# EAGLE design vcm-scanner (EAGLE 7.2.0)
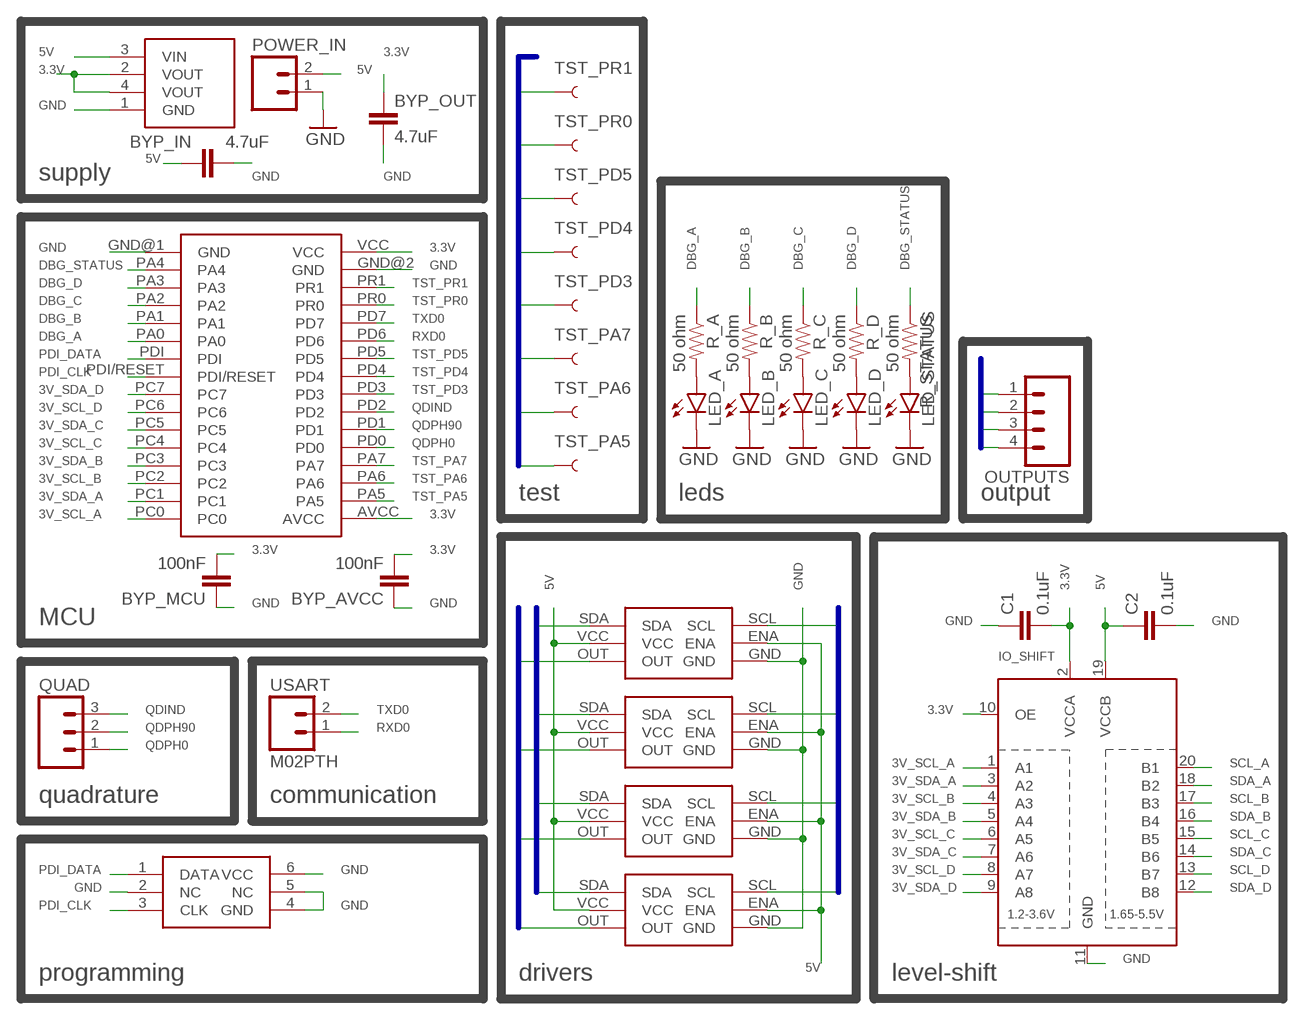
[diagram p0: schematic, sheet 1]

## Parts
BYP_AVCC  100nF  4.7UF-6.3V-10%(0603)0603  [0603-CAP]
BYP_IN  4.7uF  4.7UF-6.3V-10%(0603)0603  [0603-CAP]
BYP_MCU  100nF  4.7UF-6.3V-10%(0603)0603  [0603-CAP]
BYP_OUT  4.7uF  4.7UF-6.3V-10%(0603)0603  [0603-CAP]
C1  0.1uF  0.1UF-25V(+80/-20%)(0603)  [0603-CAP]
C2  0.1uF  0.1UF-25V(+80/-20%)(0603)  [0603-CAP]
DRIVER_A  LV8498CT  [LV8498CT-WLP6K]
DRIVER_B  LV8498CT  [LV8498CT-WLP6K]
DRIVER_C  LV8498CT  [LV8498CT-WLP6K]
DRIVER_D  LV8498CT  [LV8498CT-WLP6K]
IO_SHIFT  TXB0108PWR  [TSSOP20]
LED_A  LED0603  [LED-0603]
LED_B  LED0603  [LED-0603]
LED_C  LED0603  [LED-0603]
LED_D  LED0603  [LED-0603]
LED_STATUS  LED0603  [LED-0603]
MCU  ATXMEGA8E5-32A  [ATXMEGA8E5-32A]
OUTPUTS  M04PTH  [1X04]
PDI_PROG  AVR_PDI_PROG  [2X3]
POWER_IN  M02PTH  [1X02]
QUAD  M03PTH  [1X03]
R_A  50 ohm  RESISTOR0603  [0603-RES]
R_B  50 ohm  RESISTOR0603  [0603-RES]
R_C  50 ohm  RESISTOR0603  [0603-RES]
R_D  50 ohm  RESISTOR0603  [0603-RES]
R_STATUS  50 ohm  RESISTOR0603  [0603-RES]
SUPPLY  ZLDO1117  [SOT223]
TST_PA5  TEST-POINT3X5  [PAD.03X.05]
TST_PA6  TEST-POINT3X5  [PAD.03X.05]
TST_PA7  TEST-POINT3X5  [PAD.03X.05]
TST_PD3  TEST-POINT3X5  [PAD.03X.05]
TST_PD4  TEST-POINT3X5  [PAD.03X.05]
TST_PD5  TEST-POINT3X5  [PAD.03X.05]
TST_PR0  TEST-POINT3X5  [PAD.03X.05]
TST_PR1  TEST-POINT3X5  [PAD.03X.05]
USART  M02PTH  [1X02]

## Nets
3.3V: BYP_AVCC.2 BYP_MCU.2 BYP_OUT.1 C1.2 IO_SHIFT.2(VCCA) IO_SHIFT.10(OE) MCU.AVCC MCU.VCC SUPPLY.2(VOUT) SUPPLY.4(VOUT)
3V_SCL_A: IO_SHIFT.1(A1) MCU.PC0
3V_SCL_B: IO_SHIFT.4(A3) MCU.PC2
3V_SCL_C: IO_SHIFT.6(A5) MCU.PC4
3V_SCL_D: IO_SHIFT.8(A7) MCU.PC6
3V_SDA_A: IO_SHIFT.3(A2) MCU.PC1
3V_SDA_B: IO_SHIFT.5(A4) MCU.PC3
3V_SDA_C: IO_SHIFT.7(A6) MCU.PC5
3V_SDA_D: IO_SHIFT.9(A8) MCU.PC7
5V: BYP_IN.1 C2.1 DRIVER_A.ENA DRIVER_A.VCC DRIVER_B.ENA DRIVER_B.VCC DRIVER_C.ENA DRIVER_C.VCC DRIVER_D.ENA DRIVER_D.VCC IO_SHIFT.19(VCCB) POWER_IN.2 SUPPLY.3(VIN)
DBG_A: MCU.PA0 R_A.1
DBG_B: MCU.PA1 R_B.1
DBG_C: MCU.PA2 R_C.1
DBG_D: MCU.PA3 R_D.1
DBG_STATUS: MCU.PA4 R_STATUS.1
GND: BYP_AVCC.1 BYP_IN.2 BYP_MCU.1 BYP_OUT.2 C1.1 C2.2 DRIVER_A.GND DRIVER_B.GND DRIVER_C.GND DRIVER_D.GND IO_SHIFT.11(GND) LED_A.C LED_B.C LED_C.C LED_D.C LED_STATUS.C MCU.GND@1(GND) MCU.GND@2(GND) PDI_PROG.2(NC) PDI_PROG.4(GND) PDI_PROG.5(NC) PDI_PROG.6(VCC) POWER_IN.1 SUPPLY.1(GND)
N$1: LED_A.A R_A.2
N$2: LED_B.A R_B.2
N$3: LED_C.A R_C.2
N$4: LED_D.A R_D.2
N$5: LED_STATUS.A R_STATUS.2
OUT_A: DRIVER_A.OUT OUTPUTS.1
OUT_B: DRIVER_B.OUT OUTPUTS.2
OUT_C: DRIVER_C.OUT OUTPUTS.3
OUT_D: DRIVER_D.OUT OUTPUTS.4
PDI_CLK: MCU.PDI/RESET PDI_PROG.3(CLK)
PDI_DATA: MCU.PDI PDI_PROG.1(DATA)
QDIND: MCU.PD2 QUAD.3
QDPH0: MCU.PD0 QUAD.1
QDPH90: MCU.PD1 QUAD.2
RXD0: MCU.PD6 USART.1
SCL_A: DRIVER_A.SCL IO_SHIFT.20(B1)
SCL_B: DRIVER_B.SCL IO_SHIFT.17(B3)
SCL_C: DRIVER_C.SCL IO_SHIFT.15(B5)
SCL_D: DRIVER_D.SCL IO_SHIFT.13(B7)
SDA_A: DRIVER_A.SDA IO_SHIFT.18(B2)
SDA_B: DRIVER_B.SDA IO_SHIFT.16(B4)
SDA_C: DRIVER_C.SDA IO_SHIFT.14(B6)
SDA_D: DRIVER_D.SDA IO_SHIFT.12(B8)
TST_PA5: MCU.PA5 TST_PA5.P$1
TST_PA6: MCU.PA6 TST_PA6.P$1
TST_PA7: MCU.PA7 TST_PA7.P$1
TST_PD3: MCU.PD3 TST_PD3.P$1
TST_PD4: MCU.PD4 TST_PD4.P$1
TST_PD5: MCU.PD5 TST_PD5.P$1
TST_PR0: MCU.PR0 TST_PR0.P$1
TST_PR1: MCU.PR1 TST_PR1.P$1
TXD0: MCU.PD7 USART.2

## Buses
OUT_A,OUT_B,OUT_C,OUT_D
SCL_A,SCL_B,SCL_C,SCL_D
SDA_A,SDA_B,SDA_C,SDA_D
TST_PR1,TST_PR0,TST_PD5,TST_PD4,TST_PD3,TST_PA7,TST_PA6,TST_PA5

## Notes on the sheet
- supply
- test | leds | output
- MCU
- quadrature | communication
- programming | drivers | level-shift

## Library data of the parts
BYP_AVCC BYP_MCU = SparkFun-Capacitors:4.7UF-6.3V-10%(0603): CAP-08280; PROD_ID: CAP-08280; VALUE: 4.7uF
BYP_IN BYP_OUT = SparkFun-Capacitors:4.7UF-6.3V-10%(0603): CAP-08280; PROD_ID: CAP-08280
C1 C2 = SparkFun-Capacitors:0.1UF-25V(+80/-20%)(0603): CAP-00810 Ceramic Standard decoupling cap; PROD_ID: CAP-00810
DRIVER_A DRIVER_B DRIVER_C DRIVER_D = owen:LV8498CT
IO_SHIFT = adafruit:TXB0108PWR: 8-Bit Bi-Directional Level Shifter 1.2V-3.6V (VCCA) to 1.65V-5.5V (VCCB) bi-directional level shifter with auto direction sensing. Max data rate - VCCA 1.8V: 20Mbps (50ns), VCCA 3.3V: 100Mbps (10ns) Digikey: 296-21527-1-ND
LED_A LED_B LED_C LED_D LED_STATUS = SparkFun-LED:LED: LEDs Standard schematic elements and footprints for 5mm, 3mm, 1206, and 0603 sized LEDs. 5mm - Spark Fun Electronics SKU : COM-00529 (and others)
MCU = owen:ATXMEGA8E5-32A
OUTPUTS = SparkFun-Connectors:M04: Header 4 Standard 4-pin 0.1" header. Use with straight break away headers (SKU : PRT-00116), right angle break away headers (PRT-00553), swiss pins (PRT-00743), machine pins (PRT-00117), and female headers (PRT-00115). Molex polarized connector foot print use with SKU : PRT-08231 with associated crimp pins and housings. 1MM SMD Version SKU: PRT-10208
PDI_PROG = owen:AVR_PDI_PROG
POWER_IN USART = SparkFun-Connectors:M02: Standard 2-pin 0.1" header. Use with - straight break away headers ( PRT-00116) - right angle break away headers (PRT-00553) - swiss pins (PRT-00743) - machine pins (PRT-00117) - female headers (PRT-00115) Molex polarized connector foot print use with: PRT-08233 with associated crimp pins and housings. 2.54_SCREWTERM for use with PRT-10571. 3.5mm Screw Terminal footprints for PRT-08084 5mm Screw Terminal footprints for use with PRT-08432
QUAD = SparkFun-Connectors:M03: Header 3 Standard 3-pin 0.1" header. Use with straight break away headers (SKU : PRT-00116), right angle break away headers (PRT-00553), swiss pins (PRT-00743), machine pins (PRT-00117), and female headers (PRT-00115). Molex polarized connector foot print use with SKU : PRT-08232 with associated crimp pins and housings.
R_A R_B R_C R_D R_STATUS = SparkFun-Resistors:RESISTOR: Resistor Basic schematic elements and footprints for 0603, 1206, and PTH resistors.
SUPPLY = owen:ZLDO1117
TST_PA5-TST_PA7 TST_PD3-TST_PD5 TST_PR0 TST_PR1 = SparkFun-Passives:TEST-POINT: Bare copper test points for troubleshooting or ICT

## Board
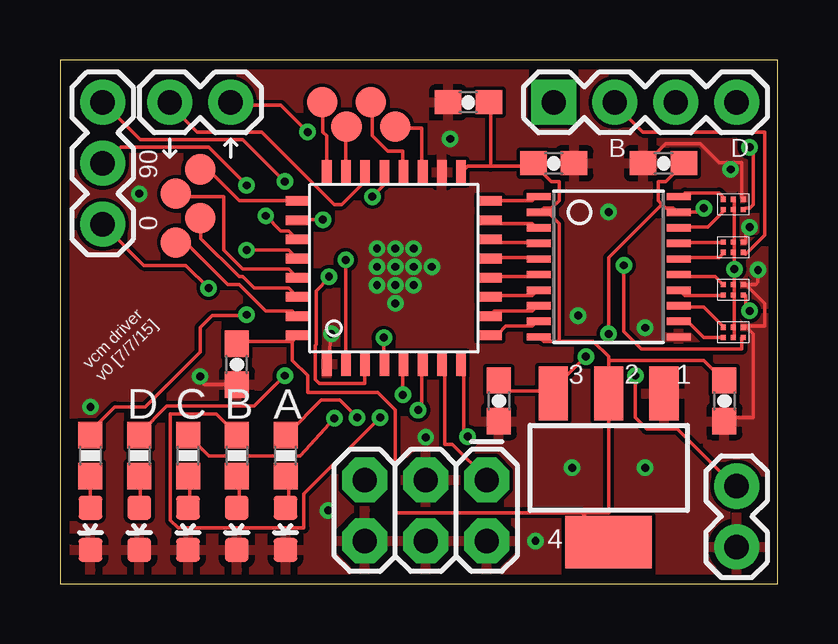
[diagram p1: board, top side]
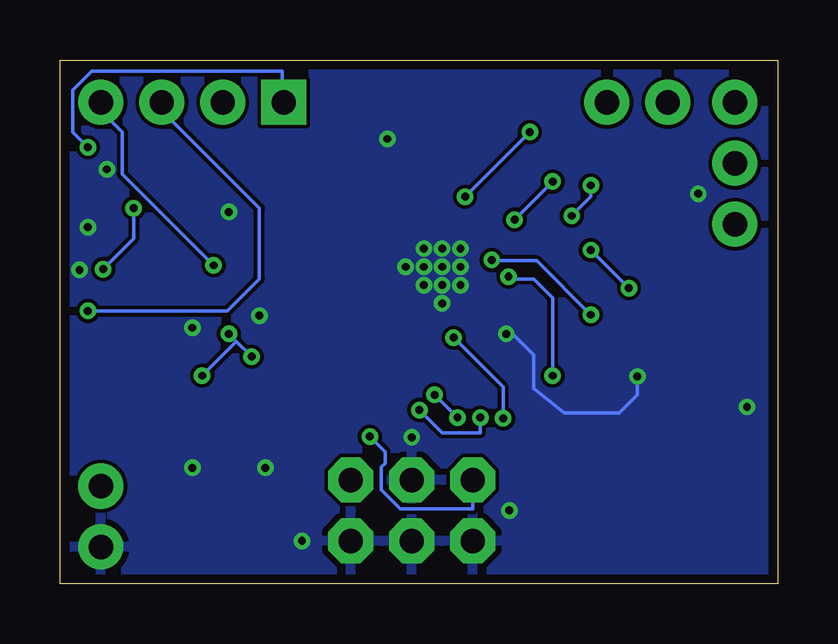
[diagram p2: board, bottom side, seen from below]

Size 29.9 x 21.83 mm. Coordinates in mm from the lower left corner, seen from the top.
Outline: 0,0 29.9,0 29.9,21.83 0,21.83 0,0
Copper layers (1*16): Top 0.0356mm / dielectric 1.5011mm / Bottom 0.0356mm
Design rules "OSHpark": minimum track width 6mil, minimum drill 13mil, track to track 6mil, track to pad 6mil, pad to pad 6mil, via to via 6mil, smd to smd 6mil, copper to edge 15mil, drill to drill 6mil, minimum pad ring 7mil, minimum via ring 7mil, stop-mask expansion 3mil, vias tented up to drill 18mil, thermal gap 10mil

### Footprints (pad centres in the part's own frame; a part is rotated, then mirrored left to right if it is on the bottom)
0603-CAP = smd 1.1 x 1: 1 -0.85,0; 2 0.85,0
LV8498CT-WLP6K = smd 0.22 x 0.22: ENA 0.235,-0.65; GND 0.235,-0.235; OUT 0.665,-0.235; SCL 0.235,-1.065; SDA 0.665,-1.065; VCC 0.665,-0.65
TSSOP20 = smd 0.305 x 0.991: 1 -2.925,-2.918; 2 -2.275,-2.918; 3 -1.625,-2.918; 4 -0.975,-2.918; 5 -0.325,-2.918; 6 0.325,-2.918; 7 0.975,-2.918; 8 1.625,-2.918; 9 2.275,-2.918; 10 2.925,-2.918; 11 2.925,2.918; 12 2.275,2.918; 13 1.625,2.918; 14 0.975,2.918; 15 0.325,2.918; 16 -0.325,2.918; 17 -0.975,2.918; 18 -1.625,2.918; 19 -2.275,2.918; 20 -2.925,2.918
LED-0603 = smd 1 x 1: A 0,-0.877; C 0,0.877
ATXMEGA8E5-32A = smd 0.4 x 1: AVCC 0.7,0.5; PA5 1.5,0.5; PA6 2.3,0.5; PA7 3.1,0.5; PC0 6.3,-7.5; PC1 5.5,-7.5; PC2 4.7,-7.5; PC3 3.9,-7.5; PC4 3.1,-7.5; PC5 2.3,-7.5; PC6 1.5,-7.5; PC7 0.7,-7.5; PD0 3.9,0.5; PD1 4.7,0.5; PD2 5.5,0.5; PD3 6.3,0.5 | smd 1 x 0.4: GND@1 -0.5,-0.7; GND@2 7.5,-5.5; PA0 -0.5,-4.7; PA1 -0.5,-3.9; PA2 -0.5,-3.1; PA3 -0.5,-2.3; PA4 -0.5,-1.5; PD4 7.5,-0.7; PD5 7.5,-1.5; PD6 7.5,-2.3; PD7 7.5,-3.1; PDI -0.5,-5.5; PDI/RESET -0.5,-6.3; PR0 7.5,-3.9; PR1 7.5,-4.7; VCC 7.5,-6.3
1X04 = drill 1.016 pad 1.88 square: 1 0,0 | drill 1.016 pad 1.88: 2 2.54,0; 3 5.08,0; 4 7.62,0
2X3 = drill 1.016 pad 1.88 octagon: 1 0,0; 2 2.54,0; 3 5.08,0; 4 5.08,2.54; 5 2.54,2.54; 6 0,2.54
1X02 = drill 1.016 pad 1.88: 1 0,0; 2 2.54,0
1X03 = drill 1.016 pad 1.88: 1 0,0; 2 2.54,0; 3 5.08,0
0603-RES = smd 1.1 x 1: 1 -0.85,0; 2 0.85,0
SOT223 = smd 1.219 x 2.235: 1 -2.311,-3.099; 2 0,-3.099; 3 2.311,-3.099 | smd 3.6 x 2.2: 4 0,3.099
PAD.03X.05 = smd 1.27 x 1.27: P$1 0,0

### Placement (x,y rotation side)
BYP_AVCC  17.02,20.07 0 top
BYP_IN  18.29,7.62 270 top
BYP_MCU  7.37,9.14 90 top
BYP_OUT  27.69,7.62 270 top
C1  20.57,17.53 180 top
C2  25.15,17.53 180 top
DRIVER_A  28.7,16.26 270 top
DRIVER_B  28.7,14.48 270 top
DRIVER_C  28.7,12.7 270 top
DRIVER_D  28.7,10.92 270 top
IO_SHIFT  22.86,13.21 270 top
LED_A  9.4,2.29 180 top
LED_B  7.37,2.29 180 top
LED_C  5.33,2.29 180 top
LED_D  3.3,2.29 180 top
LED_STATUS  1.27,2.29 180 top
MCU  10.41,9.65 90 top
OUTPUTS  20.57,20.07 0 top
PDI_PROG  17.78,4.32 180 top
POWER_IN  28.19,1.52 90 top
QUAD  1.78,14.99 90 top
R_A  9.4,5.33 270 top
R_B  7.37,5.33 270 top
R_C  5.33,5.33 270 top
R_D  3.3,5.33 270 top
R_STATUS  1.27,5.33 270 top
SUPPLY  22.86,4.83 180 top
TST_PA5  4.83,14.22 0 top
TST_PA6  5.84,15.24 0 top
TST_PA7  4.83,16.26 0 top
TST_PD3  5.84,17.27 0 top
TST_PD4  10.92,20.07 0 top
TST_PD5  11.94,19.05 0 top
TST_PR0  12.95,20.07 0 top
TST_PR1  13.97,19.05 0 top
USART  4.57,20.07 0 top

### Tracks (layer width: path | path; a pad name or v marks a point on that pad's centre or on a via)
3.3V
  Top 0.152: 20.48,15.65 20.16,15.65 20,15.49 IO_SHIFT.2 | 20.48,15.65 20.8,15.97 20.8,16.76 20.48,16.76 19.84,17.4 C1.2 19.68,17.4 17.94,17.4 | 17.94,17.4 16.99,17.4 16.83,17.24 MCU.VCC | 17.94,17.4 17.94,19.94 BYP_AVCC.2 | 20.8,10.1 22.23,10.1 22.86,9.46 22.86,9.3 | 20.8,10.1 20.16,10.1 20,10.26 IO_SHIFT.10 | 22.86,9.3 SUPPLY.2 22.86,2.95 21.75,2.95 | 22.86,9.3 26.83,9.3 27.62,8.51 BYP_OUT.1 | 20.48,15.65 20.48,15.34 20.8,15.02 20.8,10.1 | 9.68,10.1 9.84,10.26 MCU.AVCC | 9.68,10.1 7.46,10.1 BYP_MCU.2 | 9.68,10.1 9.68,9.3 10.32,8.67 10.32,7.97 13.24,7.97 13.97,7.24 13.97,2.95 21.75,2.95 | 21.75,2.95 22.86,1.84 SUPPLY.4
3V_SCL_A
  Top 0.152: IO_SHIFT.1 19.84,16.13 19.68,15.97 17.94,15.97 MCU.PC0
3V_SCL_B
  Top 0.152: IO_SHIFT.4 19.84,14.22 17.94,14.22 MCU.PC2
3V_SCL_C
  Top 0.152: IO_SHIFT.6 19.84,12.79 17.94,12.79 MCU.PC4
3V_SCL_D
  Top 0.152: IO_SHIFT.8 19.84,11.53 19.68,11.37 18.1,11.37 17.94,11.21 MCU.PC6
3V_SDA_A
  Top 0.152: IO_SHIFT.3 19.84,14.86 19.68,15.02 17.94,15.02 MCU.PC1
3V_SDA_B
  Top 0.152: IO_SHIFT.5 19.84,13.59 17.94,13.59 MCU.PC3
3V_SDA_C
  Top 0.152: IO_SHIFT.7 19.84,12.16 19.68,12 17.94,12 MCU.PC5
3V_SDA_D
  Top 0.152: IO_SHIFT.9 19.84,10.89 19.68,10.73 18.57,10.73 18.26,10.41 17.94,10.41 MCU.PC7
5V  (via drill 0.33)
  Top 0.152: DRIVER_A.ENA 28.1,15.97 28.1,15.65 DRIVER_A.VCC 28.1,15.49 28.1,14.22 | 28.1,14.22 28.1,13.91 DRIVER_B.VCC 28.1,13.75 v28.1,13.11 28.1,12.48 | 28.1,10.73 28.1,10.26 DRIVER_D.VCC | 28.1,12.48 28.1,12 | 28.1,12 28.1,10.73 | 28.1,10.73 DRIVER_D.ENA | 28.1,12 DRIVER_C.VCC | 28.1,12.48 DRIVER_C.ENA | 28.1,14.22 DRIVER_B.ENA | 25.08,15.81 24.92,15.97 24.92,16.76 25.24,16.76 25.88,17.4 C2.1 | 25.08,15.81 25.24,15.65 25.56,15.65 25.72,15.49 IO_SHIFT.19 25.88,15.49 26.67,15.49 v26.83,15.65 | 20.48,8.03 18.73,8.03 18.41,8.35 BYP_IN.1 | 25.08,15.81 22.86,13.59 v22.86,10.41 | 20.48,8.03 v21.91,9.46 | 20.48,8.03 SUPPLY.3 | v23.97,8.67 23.97,6.92 24.45,6.45 25.72,6.45 28.1,4.06 POWER_IN.2
  Bottom 0.152: v21.91,9.46 22.54,10.1 | 22.54,10.1 v22.86,10.41 | v28.1,13.11 26.83,14.38 v26.83,15.65 | 22.54,10.1 v23.97,8.67
DBG_A  (via drill 0.33)
  Top 0.152: v14.92,7.24 15.08,7.24 15.08,9.14 MCU.PA0 | v12.38,6.92 11.65,7.65 10.89,7.65 9.53,6.29 R_A.1
  Bottom 0.152: v14.92,7.24 13.97,6.29 12.38,6.29 v12.38,6.92
DBG_B  (via drill 0.33)
  Top 0.152: v14.29,7.87 14.29,9.14 MCU.PA1 | v13.34,6.92 10.16,3.75 10.16,2.32 4.92,2.32 4.6,2.63 4.6,7.08 6.51,7.08 7.3,6.29 R_B.1
  Bottom 0.152: v13.34,6.92 v14.29,7.87
DBG_C  (via drill 0.33)
  Top 0.152: v13.49,10.26 13.49,9.3 MCU.PA2 | v11.43,6.89 10,5.33 6.19,5.33 5.4,6.13 R_C.1
  Bottom 0.152: v13.49,10.26 11.43,8.19 v11.43,6.89
DBG_D  (via drill 0.33)
  Top 0.152: v9.37,8.67 8.1,7.4 4.45,7.4 3.33,6.29 R_D.1 | MCU.PA3 12.7,8.35 10.79,8.35 10.64,8.51 10.64,9.94 10.67,9.97 10.67,12.19 11.21,12.73 v11.21,12.79
  Bottom 0.152: v9.37,8.67 9.37,11.91 10.16,12.7 11.11,12.7 v11.21,12.79
DBG_STATUS  (via drill 0.33)
  Top 0.152: v11.91,13.49 11.91,9.3 MCU.PA4 | R_STATUS.1 1.27,6.35 2.29,7.37 3.56,7.37 5.84,9.65 5.84,10.67 6.35,11.18 7.75,11.18 v7.78,11.21
  Bottom 0.152: v7.78,11.21 10.03,13.46 11.87,13.46 v11.91,13.49
GND  (via drill 0.33)
  Top 0.152: 28.57,10.73 28.89,10.41 28.89,6.92 27.78,6.92 BYP_OUT.2 | 28.57,12.48 29.37,11.68 29.37,10.73 28.57,10.73 | 28.57,12.48 DRIVER_C.GND | 28.57,10.73 DRIVER_D.GND | v28.73,14.86 28.57,14.86 28.57,14.22 DRIVER_B.GND | DRIVER_A.GND 28.42,16.13 28.42,17.56 27.46,17.56 26.67,18.35 25.24,18.35 24.45,17.56 C2.2 | 7.53,8.29 BYP_MCU.1 6.01,8.29 v5.84,8.64 | v11.3,10.41 11.18,9.21 MCU.GND@1 | 28.57,12.48 28.99,12.48 29.08,12.57 v29.08,13.08
  Bottom 0.152: v5.84,8.64 5.84,7.87 6.6,7.11 8.89,7.11 10.16,8.13 10.16,9.53 11.3,10.67 v11.3,10.41
  other vias: 1.27,7.37 22.86,15.49 16.26,18.54 24.38,10.67 24.38,4.83 21.34,4.83 3.3,16.26 11.18,3.05 19.81,1.78 27.94,17.27 13.97,13.21 13.97,12.45 13.21,13.21 13.97,13.97 14.73,13.21 13.21,13.97 13.21,12.45 14.73,12.45 14.73,13.97 13.97,11.68 15.49,13.21 15.24,6.1 21.59,11.18
  pour Top (isolate 0.152): 0,0 29.97,0 29.97,21.84 0,21.84
  pour Bottom (isolate 0.152): 0,0 0,21.84 29.97,21.84 29.97,0
N$1
  Top 0.152: LED_A.A 9.53,3.27 9.53,4.38 R_A.2
N$2
  Top 0.152: LED_B.A 7.46,3.27 7.46,4.38 R_B.2
N$3
  Top 0.152: LED_C.A 5.4,3.27 5.4,4.38 R_C.2
N$4
  Top 0.152: LED_D.A 3.33,3.27 3.33,4.38 R_D.2
N$5
  Top 0.152: R_STATUS.2 LED_STATUS.A
OUT_A  (via drill 0.33)
  Top 0.152: v28.73,18.19 28.89,18.19 28.89,15.81 28.73,15.65 28.57,15.65 DRIVER_A.OUT
  Bottom 0.152: v28.73,18.19 29.37,18.83 29.37,20.57 28.57,21.37 20.64,21.37 20.64,20.1 OUTPUTS.1
OUT_B
  Top 0.152: DRIVER_B.OUT 28.57,13.75 29.37,14.54 29.37,18.83 24.29,18.83 23.18,19.94 OUTPUTS.2
OUT_C  (via drill 0.33)
  Top 0.152: v28.73,11.37 28.57,11.37 28.57,12 DRIVER_C.OUT
  Bottom 0.152: OUTPUTS.3 25.56,19.94 25.56,19.62 21.59,15.65 21.59,12.7 22.92,11.37 v28.73,11.37
OUT_D  (via drill 0.33)
  Top 0.152: v23.5,13.27 23.5,10.51 24.23,9.78 28.42,9.78 28.42,10.26 DRIVER_D.OUT
  Bottom 0.152: v23.5,13.27 27.3,17.08 27.3,18.83 28.1,19.62 28.1,19.94 OUTPUTS.4
PDI_CLK  (via drill 0.33)
  Top 0.152: v16.99,6.13 16.83,6.13 16.83,9.14 MCU.PDI/RESET
  Bottom 0.152: v16.99,6.13 16.35,5.49 16.35,5.02 16.51,4.86 16.51,3.9 15.72,3.11 12.7,3.11 PDI_PROG.3
PDI_DATA
  Top 0.152: MCU.PDI 16.03,9.14 16.03,5.81 16.35,5.81 17.78,4.38 PDI_PROG.1
QDIND  (via drill 0.33)
  Top 0.152: v10.95,15.18 10,15.18 MCU.PD2 | v9.37,16.76 7.62,18.51 3.33,18.51 QUAD.3
  Bottom 0.152: v9.37,16.76 v10.95,15.18
QDPH0  (via drill 0.33)
  Top 0.152: v7.78,13.91 9.53,13.91 9.84,13.59 MCU.PD0 | v6.19,12.32 5.24,13.27 3.49,13.27 QUAD.1
  Bottom 0.152: v6.19,12.32 v7.78,13.91
QDPH90  (via drill 0.33)
  Top 0.152: v8.57,15.34 9.21,14.7 9.53,14.7 9.84,14.38 MCU.PD1 | v7.78,16.61 6.19,18.19 2.54,18.19 1.91,17.56 QUAD.2
  Bottom 0.152: v8.57,15.34 7.78,16.13 v7.78,16.61
RXD0
  Top 0.152: MCU.PD6 12.7,17.08 12.7,16.76 11.75,15.81 11.43,15.81 8.41,18.83 5.71,18.83 4.6,19.94 USART.1
SCL_A
  Top 0.152: DRIVER_A.SCL 27.62,16.13 27.46,16.29 26.04,16.29 25.88,16.13 IO_SHIFT.20
SCL_B
  Top 0.152: DRIVER_B.SCL 27.62,14.22 25.88,14.22 IO_SHIFT.17
SCL_C
  Top 0.152: DRIVER_C.SCL 27.62,12.48 27.3,12.79 25.88,12.79 IO_SHIFT.15
SCL_D
  Top 0.152: DRIVER_D.SCL 27.62,10.73 26.83,11.53 25.88,11.53 IO_SHIFT.13
SDA_A
  Top 0.152: DRIVER_A.SDA 27.62,15.49 26.99,14.86 25.88,14.86 IO_SHIFT.18
SDA_B
  Top 0.152: DRIVER_B.SDA 27.62,13.75 27.46,13.59 25.88,13.59 IO_SHIFT.16
SDA_C
  Top 0.152: DRIVER_C.SDA 27.62,12 26.04,12 25.88,12.16 IO_SHIFT.14
SDA_D
  Top 0.152: DRIVER_D.SDA 27.62,10.26 26.83,10.26 26.19,10.89 25.88,10.89 IO_SHIFT.12
TST_PA5
  Top 0.152: TST_PA5.P$1 5.24,14.22 6.99,12.48 7.46,12.48 8.57,11.37 9.68,11.37 9.84,11.21 MCU.PA5
TST_PA6
  Top 0.152: MCU.PA6 9.84,12 9.53,12.32 8.1,12.32 7.62,12.79 7.46,12.79 5.87,14.38 5.87,15.18 TST_PA6.P$1
TST_PA7
  Top 0.152: MCU.PA7 9.84,12.79 9.53,13.11 7.62,13.11 6.83,13.91 6.83,16.13 4.92,16.13 TST_PA7.P$1
TST_PD3
  Top 0.152: MCU.PD3 9.84,15.97 7.46,15.97 6.19,17.24 5.87,17.24 TST_PD3.P$1
TST_PD4
  Top 0.152: MCU.PD4 11.11,17.24 11.11,18.67 10.95,18.83 10.95,19.94 TST_PD4.P$1
TST_PD5
  Top 0.152: MCU.PD5 11.91,17.24 11.91,18.99 TST_PD5.P$1
TST_PR0
  Top 0.152: MCU.PR0 14.29,17.24 14.29,18.03 13.65,18.03 13.02,18.67 13.02,19.94 TST_PR0.P$1
TST_PR1
  Top 0.152: MCU.PR1 15.08,17.24 15.08,18.99 13.97,18.99 TST_PR1.P$1
TXD0  (via drill 0.33)
  Top 0.152: v13.02,16.13 13.49,16.61 13.49,17.08 MCU.PD7 | v10.32,18.83 9.21,19.94 7.14,19.94 USART.2
  Bottom 0.152: v10.32,18.83 v13.02,16.13

### Text on the board
tPlace: B | D | 90 | 0 | vcm driver / v0 [7/7/15]
tNames: D | C | B | A